# EAGLE board v6 (EAGLE 9.6.2)
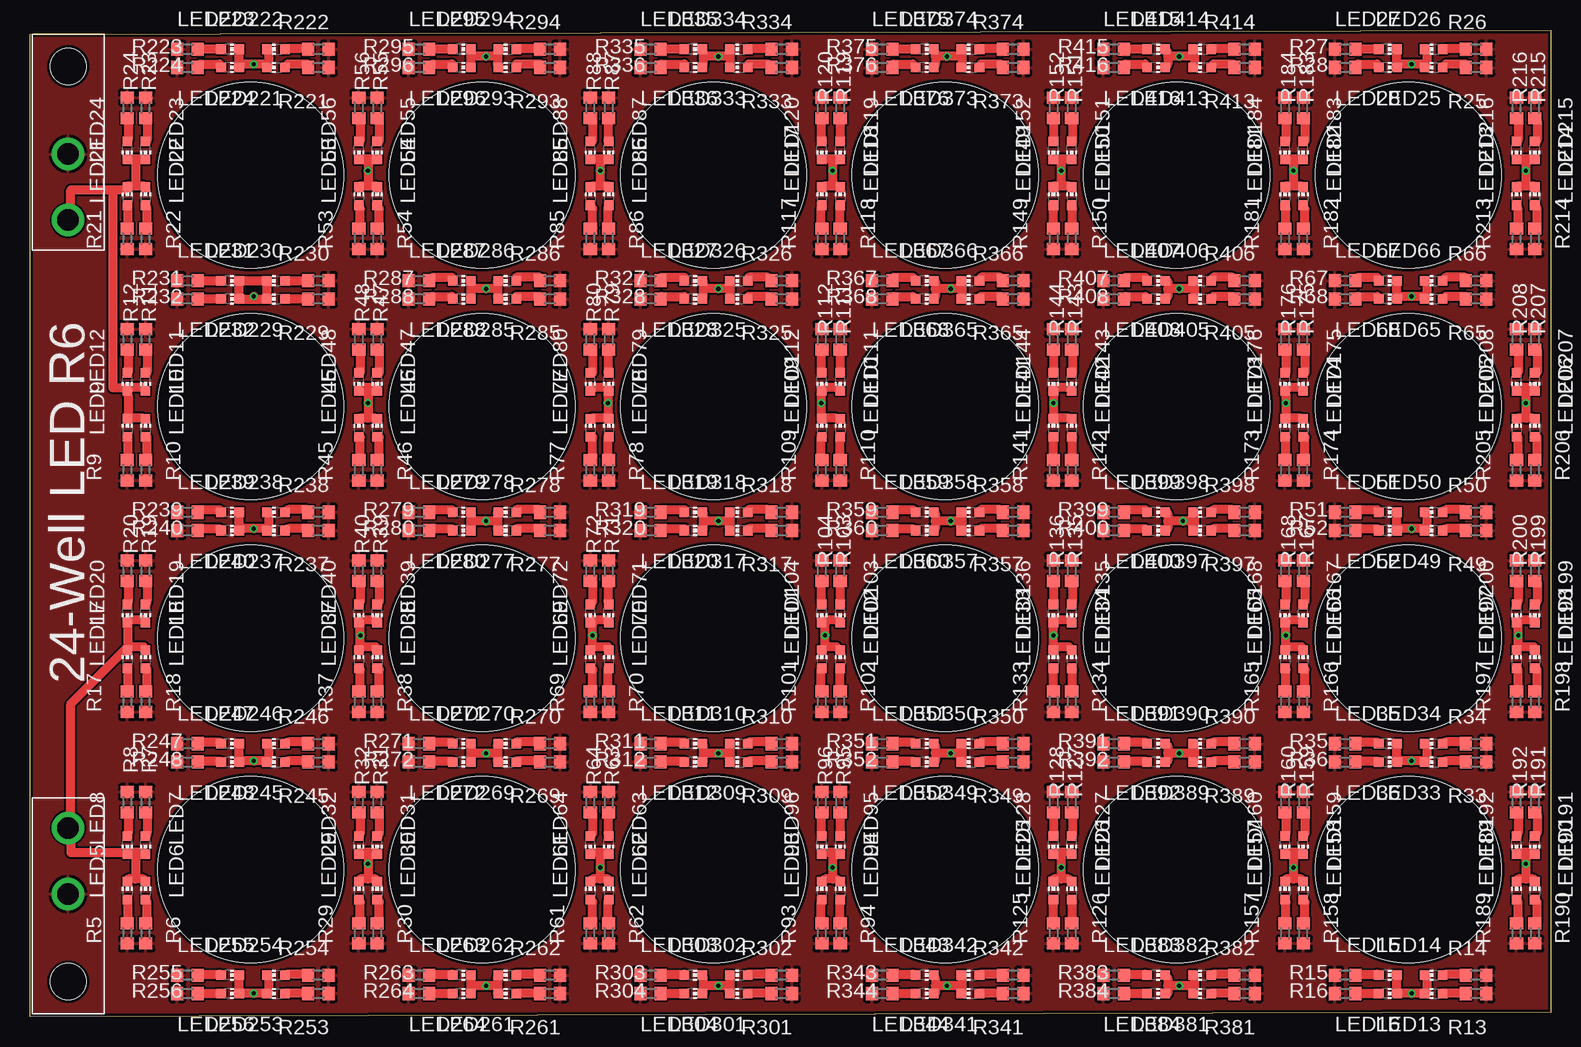
[diagram p1: board, top side]
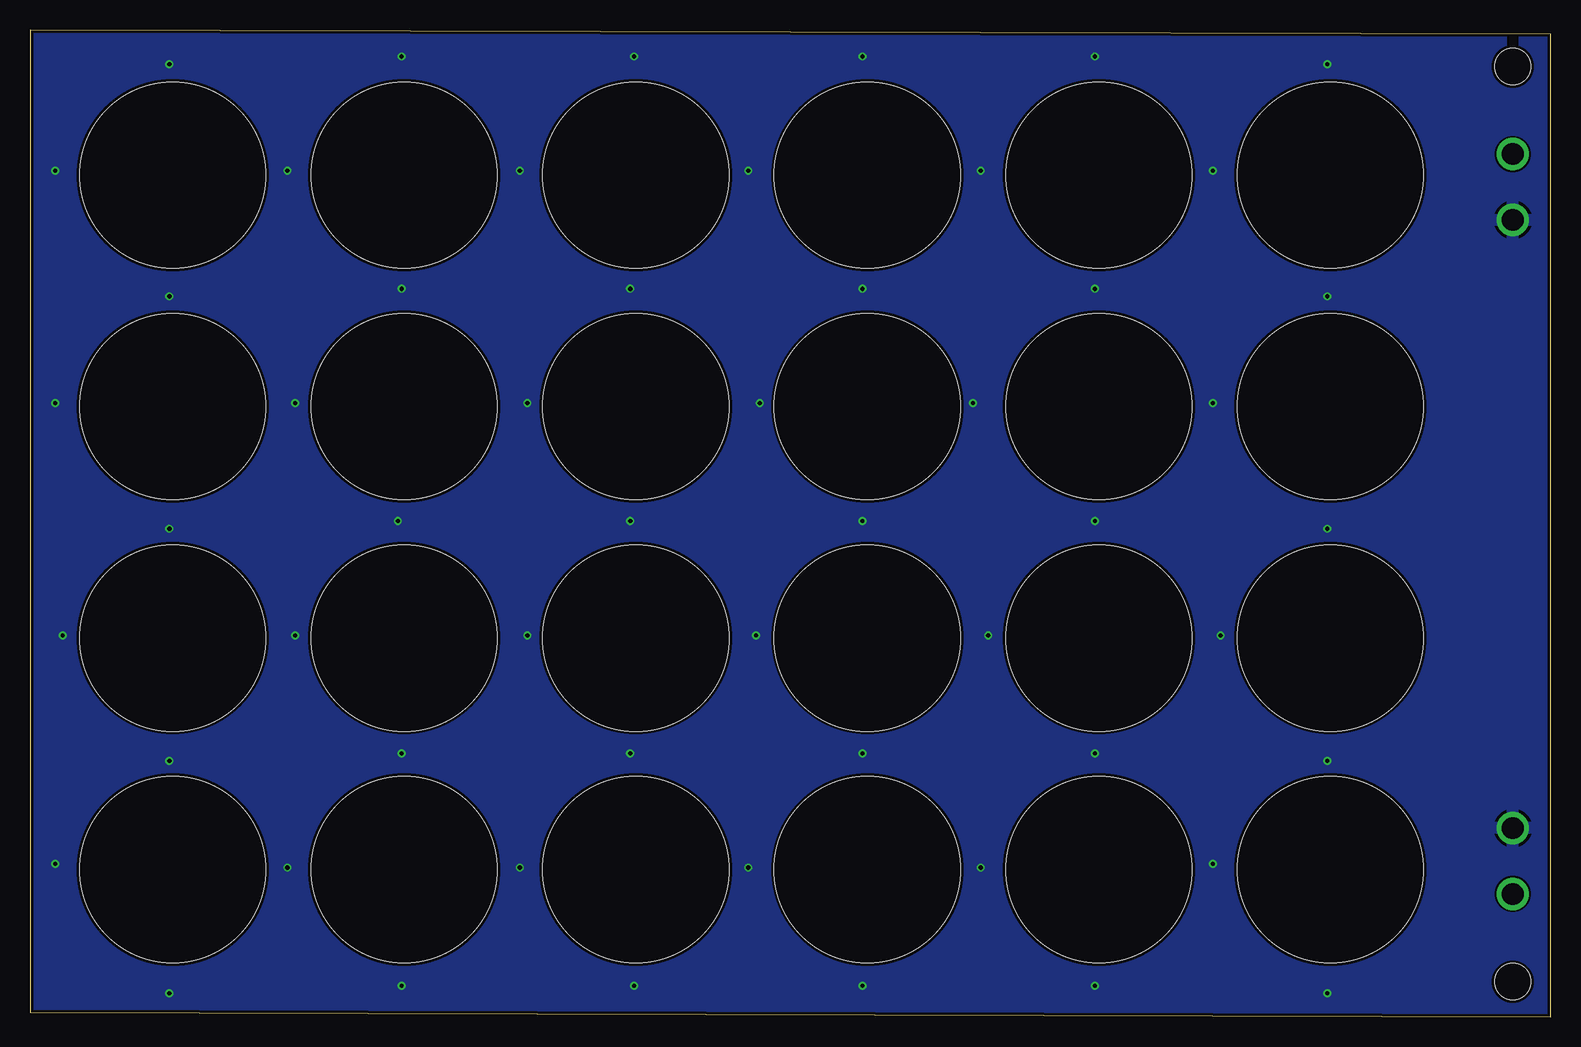
[diagram p2: board, bottom side, seen from below]

Size 126.78 x 82.25 mm. Coordinates in mm from the lower left corner, seen from the top.
Outline: 0,0 0,81.9 126.78,82.25 126.78,0.35 0,0
Copper layers (1*16): Top 0.035mm / dielectric 1.5mm / Bottom 0.035mm
Design rules "default *": minimum track width 30mil, minimum drill 0.35mm, track to track 6mil, track to pad 6mil, pad to pad 6mil, via to via 6mil, smd to smd 6mil, copper to edge 10mil, drill to drill 6mil, minimum pad ring 10mil, minimum via ring 6mil, stop-mask expansion 4mil, vias tented up to drill 0mil, thermal gap 10mil
Holes 15.5 mm at 18.38,31.55 18.38,50.85 18.38,70.15 37.68,31.55 37.68,50.85 37.68,70.15 56.98,31.55 56.98,50.85 56.98,70.15 76.28,31.55 76.28,50.85 76.28,70.15 95.58,31.55 95.58,50.85 95.58,70.15 114.88,70.15 114.88,50.85 114.88,31.55 18.38,12.25 37.68,12.25 56.98,12.25 76.28,12.25 95.58,12.25 114.88,12.25

## Footprints (pad centres in the part's own frame; a part is rotated, then mirrored left to right if it is on the bottom)
CHIP-LED0603 = smd 0.8 x 0.8: A 0,-0.75; C 0,0.75
R0603 = smd 1 x 1.1: 1 -0.85,0; 2 0.85,0
MINI-FIT_JR_CONN = drill 1.8: P$1 0,0; P$2 0,5.5 | hole 3: 0,-7.3

## Placement (x,y rotation side)
LED5  [CHIP-LED0603]  8.12,10.5 0 top
LED6  [CHIP-LED0603]  9.64,10.5 0 top
LED7  [CHIP-LED0603]  9.64,14.31 180 top
LED8  [CHIP-LED0603]  8.12,14.31 180 top
LED9  [CHIP-LED0603]  8.12,49.1 0 top
LED10  [CHIP-LED0603]  9.64,49.1 0 top
LED11  [CHIP-LED0603]  9.64,52.91 180 top
LED12  [CHIP-LED0603]  8.12,52.91 180 top
LED13  [CHIP-LED0603]  117,1.92 90 top
LED14  [CHIP-LED0603]  117,3.45 90 top
LED15  [CHIP-LED0603]  113.19,3.45 270 top
LED16  [CHIP-LED0603]  113.19,1.92 270 top
LED17  [CHIP-LED0603]  8.12,29.8 0 top
LED18  [CHIP-LED0603]  9.64,29.8 0 top
LED19  [CHIP-LED0603]  9.64,33.61 180 top
LED20  [CHIP-LED0603]  8.12,33.61 180 top
LED21  [CHIP-LED0603]  8.12,68.4 0 top
LED22  [CHIP-LED0603]  9.64,68.4 0 top
LED23  [CHIP-LED0603]  9.64,72.21 180 top
LED24  [CHIP-LED0603]  8.12,72.21 180 top
LED25  [CHIP-LED0603]  117,79.12 90 top
LED26  [CHIP-LED0603]  117,80.65 90 top
LED27  [CHIP-LED0603]  113.19,80.65 270 top
LED28  [CHIP-LED0603]  113.19,79.12 270 top
LED29  [CHIP-LED0603]  27.42,10.5 0 top
LED30  [CHIP-LED0603]  28.94,10.5 0 top
LED31  [CHIP-LED0603]  28.94,14.31 180 top
LED32  [CHIP-LED0603]  27.42,14.31 180 top
LED33  [CHIP-LED0603]  117,21.22 90 top
LED34  [CHIP-LED0603]  117,22.75 90 top
LED35  [CHIP-LED0603]  113.19,22.75 270 top
LED36  [CHIP-LED0603]  113.19,21.22 270 top
LED37  [CHIP-LED0603]  27.42,29.8 0 top
LED38  [CHIP-LED0603]  28.94,29.8 0 top
LED39  [CHIP-LED0603]  28.94,33.61 180 top
LED40  [CHIP-LED0603]  27.42,33.61 180 top
LED45  [CHIP-LED0603]  27.42,49.1 0 top
LED46  [CHIP-LED0603]  28.94,49.1 0 top
LED47  [CHIP-LED0603]  28.94,52.91 180 top
LED48  [CHIP-LED0603]  27.42,52.91 180 top
LED49  [CHIP-LED0603]  117,40.52 90 top
LED50  [CHIP-LED0603]  117,42.05 90 top
LED51  [CHIP-LED0603]  113.19,42.05 270 top
LED52  [CHIP-LED0603]  113.19,40.52 270 top
LED53  [CHIP-LED0603]  27.42,68.4 0 top
LED54  [CHIP-LED0603]  28.94,68.4 0 top
LED55  [CHIP-LED0603]  28.94,72.21 180 top
LED56  [CHIP-LED0603]  27.42,72.21 180 top
LED61  [CHIP-LED0603]  46.72,10.5 0 top
LED62  [CHIP-LED0603]  48.24,10.5 0 top
LED63  [CHIP-LED0603]  48.24,14.31 180 top
LED64  [CHIP-LED0603]  46.72,14.31 180 top
LED65  [CHIP-LED0603]  117,59.82 90 top
LED66  [CHIP-LED0603]  117,61.35 90 top
LED67  [CHIP-LED0603]  113.19,61.35 270 top
LED68  [CHIP-LED0603]  113.19,59.82 270 top
LED69  [CHIP-LED0603]  46.72,29.8 0 top
LED70  [CHIP-LED0603]  48.24,29.8 0 top
LED71  [CHIP-LED0603]  48.24,33.61 180 top
LED72  [CHIP-LED0603]  46.72,33.61 180 top
LED77  [CHIP-LED0603]  46.72,49.1 0 top
LED78  [CHIP-LED0603]  48.24,49.1 0 top
LED79  [CHIP-LED0603]  48.24,52.91 180 top
LED80  [CHIP-LED0603]  46.72,52.91 180 top
LED85  [CHIP-LED0603]  46.72,68.4 0 top
LED86  [CHIP-LED0603]  48.24,68.4 0 top
LED87  [CHIP-LED0603]  48.24,72.21 180 top
LED88  [CHIP-LED0603]  46.72,72.21 180 top
LED93  [CHIP-LED0603]  66.02,10.5 0 top
LED94  [CHIP-LED0603]  67.54,10.5 0 top
LED95  [CHIP-LED0603]  67.54,14.31 180 top
LED96  [CHIP-LED0603]  66.02,14.31 180 top
LED101  [CHIP-LED0603]  66.02,29.8 0 top
LED102  [CHIP-LED0603]  67.54,29.8 0 top
LED103  [CHIP-LED0603]  67.54,33.61 180 top
LED104  [CHIP-LED0603]  66.02,33.61 180 top
LED109  [CHIP-LED0603]  66.02,49.1 0 top
LED110  [CHIP-LED0603]  67.54,49.1 0 top
LED111  [CHIP-LED0603]  67.54,52.91 180 top
LED112  [CHIP-LED0603]  66.02,52.91 180 top
LED117  [CHIP-LED0603]  66.02,68.4 0 top
LED118  [CHIP-LED0603]  67.54,68.4 0 top
LED119  [CHIP-LED0603]  67.54,72.21 180 top
LED120  [CHIP-LED0603]  66.02,72.21 180 top
LED125  [CHIP-LED0603]  85.32,10.5 0 top
LED126  [CHIP-LED0603]  86.84,10.5 0 top
LED127  [CHIP-LED0603]  86.84,14.31 180 top
LED128  [CHIP-LED0603]  85.32,14.31 180 top
LED133  [CHIP-LED0603]  85.32,29.8 0 top
LED134  [CHIP-LED0603]  86.84,29.8 0 top
LED135  [CHIP-LED0603]  86.84,33.61 180 top
LED136  [CHIP-LED0603]  85.32,33.61 180 top
LED141  [CHIP-LED0603]  85.32,49.1 0 top
LED142  [CHIP-LED0603]  86.84,49.1 0 top
LED143  [CHIP-LED0603]  86.84,52.91 180 top
LED144  [CHIP-LED0603]  85.32,52.91 180 top
LED149  [CHIP-LED0603]  85.32,68.4 0 top
LED150  [CHIP-LED0603]  86.84,68.4 0 top
LED151  [CHIP-LED0603]  86.84,72.21 180 top
LED152  [CHIP-LED0603]  85.32,72.21 180 top
LED157  [CHIP-LED0603]  104.62,10.5 0 top
LED158  [CHIP-LED0603]  106.14,10.5 0 top
LED159  [CHIP-LED0603]  106.14,14.31 180 top
LED160  [CHIP-LED0603]  104.62,14.31 180 top
LED165  [CHIP-LED0603]  104.62,29.8 0 top
LED166  [CHIP-LED0603]  106.14,29.8 0 top
LED167  [CHIP-LED0603]  106.14,33.61 180 top
LED168  [CHIP-LED0603]  104.62,33.61 180 top
LED173  [CHIP-LED0603]  104.62,49.1 0 top
LED174  [CHIP-LED0603]  106.14,49.1 0 top
LED175  [CHIP-LED0603]  106.14,52.91 180 top
LED176  [CHIP-LED0603]  104.62,52.91 180 top
LED181  [CHIP-LED0603]  104.62,68.4 0 top
LED182  [CHIP-LED0603]  106.14,68.4 0 top
LED183  [CHIP-LED0603]  106.14,72.21 180 top
LED184  [CHIP-LED0603]  104.62,72.21 180 top
LED189  [CHIP-LED0603]  123.92,10.5 0 top
LED190  [CHIP-LED0603]  125.44,10.5 0 top
LED191  [CHIP-LED0603]  125.44,14.31 180 top
LED192  [CHIP-LED0603]  123.92,14.31 180 top
LED197  [CHIP-LED0603]  123.92,29.8 0 top
LED198  [CHIP-LED0603]  125.44,29.8 0 top
LED199  [CHIP-LED0603]  125.44,33.61 180 top
LED200  [CHIP-LED0603]  123.92,33.61 180 top
LED205  [CHIP-LED0603]  123.92,49.1 0 top
LED206  [CHIP-LED0603]  125.44,49.1 0 top
LED207  [CHIP-LED0603]  125.44,52.91 180 top
LED208  [CHIP-LED0603]  123.92,52.91 180 top
LED213  [CHIP-LED0603]  123.92,68.4 0 top
LED214  [CHIP-LED0603]  125.44,68.4 0 top
LED215  [CHIP-LED0603]  125.44,72.21 180 top
LED216  [CHIP-LED0603]  123.92,72.21 180 top
LED221  [CHIP-LED0603]  20.5,79.12 90 top
LED222  [CHIP-LED0603]  20.5,80.65 90 top
LED223  [CHIP-LED0603]  16.69,80.65 270 top
LED224  [CHIP-LED0603]  16.69,79.12 270 top
LED229  [CHIP-LED0603]  20.5,59.82 90 top
LED230  [CHIP-LED0603]  20.5,61.35 90 top
LED231  [CHIP-LED0603]  16.69,61.35 270 top
LED232  [CHIP-LED0603]  16.69,59.82 270 top
LED237  [CHIP-LED0603]  20.5,40.52 90 top
LED238  [CHIP-LED0603]  20.5,42.05 90 top
LED239  [CHIP-LED0603]  16.69,42.05 270 top
LED240  [CHIP-LED0603]  16.69,40.52 270 top
LED245  [CHIP-LED0603]  20.5,21.22 90 top
LED246  [CHIP-LED0603]  20.5,22.75 90 top
LED247  [CHIP-LED0603]  16.69,22.75 270 top
LED248  [CHIP-LED0603]  16.69,21.22 270 top
LED253  [CHIP-LED0603]  20.5,1.92 90 top
LED254  [CHIP-LED0603]  20.5,3.45 90 top
LED255  [CHIP-LED0603]  16.69,3.45 270 top
LED256  [CHIP-LED0603]  16.69,1.92 270 top
LED261  [CHIP-LED0603]  39.8,1.92 90 top
LED262  [CHIP-LED0603]  39.8,3.45 90 top
LED263  [CHIP-LED0603]  35.99,3.45 270 top
LED264  [CHIP-LED0603]  35.99,1.92 270 top
LED269  [CHIP-LED0603]  39.8,21.22 90 top
LED270  [CHIP-LED0603]  39.8,22.75 90 top
LED271  [CHIP-LED0603]  35.99,22.75 270 top
LED272  [CHIP-LED0603]  35.99,21.22 270 top
LED277  [CHIP-LED0603]  39.8,40.52 90 top
LED278  [CHIP-LED0603]  39.8,42.05 90 top
LED279  [CHIP-LED0603]  35.99,42.05 270 top
LED280  [CHIP-LED0603]  35.99,40.52 270 top
LED285  [CHIP-LED0603]  39.8,59.82 90 top
LED286  [CHIP-LED0603]  39.8,61.35 90 top
LED287  [CHIP-LED0603]  35.99,61.35 270 top
LED288  [CHIP-LED0603]  35.99,59.82 270 top
LED293  [CHIP-LED0603]  39.8,79.12 90 top
LED294  [CHIP-LED0603]  39.8,80.65 90 top
LED295  [CHIP-LED0603]  35.99,80.65 270 top
LED296  [CHIP-LED0603]  35.99,79.12 270 top
LED301  [CHIP-LED0603]  59.1,1.92 90 top
LED302  [CHIP-LED0603]  59.1,3.45 90 top
LED303  [CHIP-LED0603]  55.29,3.45 270 top
LED304  [CHIP-LED0603]  55.29,1.92 270 top
LED309  [CHIP-LED0603]  59.1,21.22 90 top
LED310  [CHIP-LED0603]  59.1,22.75 90 top
LED311  [CHIP-LED0603]  55.29,22.75 270 top
LED312  [CHIP-LED0603]  55.29,21.22 270 top
LED317  [CHIP-LED0603]  59.1,40.52 90 top
LED318  [CHIP-LED0603]  59.1,42.05 90 top
LED319  [CHIP-LED0603]  55.29,42.05 270 top
LED320  [CHIP-LED0603]  55.29,40.52 270 top
LED325  [CHIP-LED0603]  59.1,59.82 90 top
LED326  [CHIP-LED0603]  59.1,61.35 90 top
LED327  [CHIP-LED0603]  55.29,61.35 270 top
LED328  [CHIP-LED0603]  55.29,59.82 270 top
LED333  [CHIP-LED0603]  59.1,79.12 90 top
LED334  [CHIP-LED0603]  59.1,80.65 90 top
LED335  [CHIP-LED0603]  55.29,80.65 270 top
LED336  [CHIP-LED0603]  55.29,79.12 270 top
LED341  [CHIP-LED0603]  78.4,1.92 90 top
LED342  [CHIP-LED0603]  78.4,3.45 90 top
LED343  [CHIP-LED0603]  74.59,3.45 270 top
LED344  [CHIP-LED0603]  74.59,1.92 270 top
LED349  [CHIP-LED0603]  78.4,21.22 90 top
LED350  [CHIP-LED0603]  78.4,22.75 90 top
LED351  [CHIP-LED0603]  74.59,22.75 270 top
LED352  [CHIP-LED0603]  74.59,21.22 270 top
LED357  [CHIP-LED0603]  78.4,40.52 90 top
LED358  [CHIP-LED0603]  78.4,42.05 90 top
LED359  [CHIP-LED0603]  74.59,42.05 270 top
LED360  [CHIP-LED0603]  74.59,40.52 270 top
LED365  [CHIP-LED0603]  78.4,59.82 90 top
LED366  [CHIP-LED0603]  78.4,61.35 90 top
LED367  [CHIP-LED0603]  74.59,61.35 270 top
LED368  [CHIP-LED0603]  74.59,59.82 270 top
LED373  [CHIP-LED0603]  78.4,79.12 90 top
LED374  [CHIP-LED0603]  78.4,80.65 90 top
LED375  [CHIP-LED0603]  74.59,80.65 270 top
LED376  [CHIP-LED0603]  74.59,79.12 270 top
LED381  [CHIP-LED0603]  97.7,1.92 90 top
LED382  [CHIP-LED0603]  97.7,3.45 90 top
LED383  [CHIP-LED0603]  93.89,3.45 270 top
LED384  [CHIP-LED0603]  93.89,1.92 270 top
LED389  [CHIP-LED0603]  97.7,21.22 90 top
LED390  [CHIP-LED0603]  97.7,22.75 90 top
LED391  [CHIP-LED0603]  93.89,22.75 270 top
LED392  [CHIP-LED0603]  93.89,21.22 270 top
LED397  [CHIP-LED0603]  97.7,40.52 90 top
LED398  [CHIP-LED0603]  97.7,42.05 90 top
LED399  [CHIP-LED0603]  93.89,42.05 270 top
LED400  [CHIP-LED0603]  93.89,40.52 270 top
LED405  [CHIP-LED0603]  97.7,59.82 90 top
LED406  [CHIP-LED0603]  97.7,61.35 90 top
LED407  [CHIP-LED0603]  93.89,61.35 270 top
LED408  [CHIP-LED0603]  93.89,59.82 270 top
LED413  [CHIP-LED0603]  97.7,79.12 90 top
LED414  [CHIP-LED0603]  97.7,80.65 90 top
LED415  [CHIP-LED0603]  93.89,80.65 270 top
LED416  [CHIP-LED0603]  93.89,79.12 270 top
R5  [R0603]  8.12,6.94 90 top
R6  [R0603]  9.64,6.94 90 top
R7  [R0603]  9.64,17.86 270 top
R8  [R0603]  8.12,17.86 270 top
R9  [R0603]  8.12,45.54 90 top
R10  [R0603]  9.64,45.54 90 top
R11  [R0603]  9.64,56.46 270 top
R12  [R0603]  8.12,56.46 270 top
R13  [R0603]  120.55,1.92 180 top
R14  [R0603]  120.55,3.45 180 top
R15  [R0603]  109.63,3.45 0 top
R16  [R0603]  109.63,1.92 0 top
R17  [R0603]  8.12,26.24 90 top
R18  [R0603]  9.64,26.24 90 top
R19  [R0603]  9.64,37.16 270 top
R20  [R0603]  8.12,37.16 270 top
R21  [R0603]  8.12,64.84 90 top
R22  [R0603]  9.64,64.84 90 top
R23  [R0603]  9.64,75.76 270 top
R24  [R0603]  8.12,75.76 270 top
R25  [R0603]  120.55,79.12 180 top
R26  [R0603]  120.55,80.65 180 top
R27  [R0603]  109.63,80.65 0 top
R28  [R0603]  109.63,79.12 0 top
R29  [R0603]  27.42,6.94 90 top
R30  [R0603]  28.94,6.94 90 top
R31  [R0603]  28.94,17.86 270 top
R32  [R0603]  27.42,17.86 270 top
R33  [R0603]  120.55,21.22 180 top
R34  [R0603]  120.55,22.75 180 top
R35  [R0603]  109.63,22.75 0 top
R36  [R0603]  109.63,21.22 0 top
R37  [R0603]  27.42,26.24 90 top
R38  [R0603]  28.94,26.24 90 top
R39  [R0603]  28.94,37.16 270 top
R40  [R0603]  27.42,37.16 270 top
R45  [R0603]  27.42,45.54 90 top
R46  [R0603]  28.94,45.54 90 top
R47  [R0603]  28.94,56.46 270 top
R48  [R0603]  27.42,56.46 270 top
R49  [R0603]  120.55,40.52 180 top
R50  [R0603]  120.55,42.05 180 top
R51  [R0603]  109.63,42.05 0 top
R52  [R0603]  109.63,40.52 0 top
R53  [R0603]  27.42,64.84 90 top
R54  [R0603]  28.94,64.84 90 top
R55  [R0603]  28.94,75.76 270 top
R56  [R0603]  27.42,75.76 270 top
R61  [R0603]  46.72,6.94 90 top
R62  [R0603]  48.24,6.94 90 top
R63  [R0603]  48.24,17.86 270 top
R64  [R0603]  46.72,17.86 270 top
R65  [R0603]  120.55,59.82 180 top
R66  [R0603]  120.55,61.35 180 top
R67  [R0603]  109.63,61.35 0 top
R68  [R0603]  109.63,59.82 0 top
R69  [R0603]  46.72,26.24 90 top
R70  [R0603]  48.24,26.24 90 top
R71  [R0603]  48.24,37.16 270 top
R72  [R0603]  46.72,37.16 270 top
R77  [R0603]  46.72,45.54 90 top
R78  [R0603]  48.24,45.54 90 top
R79  [R0603]  48.24,56.46 270 top
R80  [R0603]  46.72,56.46 270 top
R85  [R0603]  46.72,64.84 90 top
R86  [R0603]  48.24,64.84 90 top
R87  [R0603]  48.24,75.76 270 top
R88  [R0603]  46.72,75.76 270 top
R93  [R0603]  66.02,6.94 90 top
R94  [R0603]  67.54,6.94 90 top
R95  [R0603]  67.54,17.86 270 top
R96  [R0603]  66.02,17.86 270 top
R101  [R0603]  66.02,26.24 90 top
R102  [R0603]  67.54,26.24 90 top
R103  [R0603]  67.54,37.16 270 top
R104  [R0603]  66.02,37.16 270 top
R109  [R0603]  66.02,45.54 90 top
R110  [R0603]  67.54,45.54 90 top
R111  [R0603]  67.54,56.46 270 top
R112  [R0603]  66.02,56.46 270 top
R117  [R0603]  66.02,64.84 90 top
R118  [R0603]  67.54,64.84 90 top
R119  [R0603]  67.54,75.76 270 top
R120  [R0603]  66.02,75.76 270 top
R125  [R0603]  85.32,6.94 90 top
R126  [R0603]  86.84,6.94 90 top
R127  [R0603]  86.84,17.86 270 top
R128  [R0603]  85.32,17.86 270 top
R133  [R0603]  85.32,26.24 90 top
R134  [R0603]  86.84,26.24 90 top
R135  [R0603]  86.84,37.16 270 top
R136  [R0603]  85.32,37.16 270 top
R141  [R0603]  85.32,45.54 90 top
R142  [R0603]  86.84,45.54 90 top
R143  [R0603]  86.84,56.46 270 top
R144  [R0603]  85.32,56.46 270 top
R149  [R0603]  85.32,64.84 90 top
R150  [R0603]  86.84,64.84 90 top
R151  [R0603]  86.84,75.76 270 top
R152  [R0603]  85.32,75.76 270 top
R157  [R0603]  104.62,6.94 90 top
R158  [R0603]  106.14,6.94 90 top
R159  [R0603]  106.14,17.86 270 top
R160  [R0603]  104.62,17.86 270 top
R165  [R0603]  104.62,26.24 90 top
R166  [R0603]  106.14,26.24 90 top
R167  [R0603]  106.14,37.16 270 top
R168  [R0603]  104.62,37.16 270 top
R173  [R0603]  104.62,45.54 90 top
R174  [R0603]  106.14,45.54 90 top
R175  [R0603]  106.14,56.46 270 top
R176  [R0603]  104.62,56.46 270 top
R181  [R0603]  104.62,64.84 90 top
R182  [R0603]  106.14,64.84 90 top
R183  [R0603]  106.14,75.76 270 top
R184  [R0603]  104.62,75.76 270 top
R189  [R0603]  123.92,6.94 90 top
R190  [R0603]  125.44,6.94 90 top
R191  [R0603]  125.44,17.86 270 top
R192  [R0603]  123.92,17.86 270 top
R197  [R0603]  123.92,26.24 90 top
R198  [R0603]  125.44,26.24 90 top
R199  [R0603]  125.44,37.16 270 top
R200  [R0603]  123.92,37.16 270 top
R205  [R0603]  123.92,45.54 90 top
R206  [R0603]  125.44,45.54 90 top
R207  [R0603]  125.44,56.46 270 top
R208  [R0603]  123.92,56.46 270 top
R213  [R0603]  123.92,64.84 90 top
R214  [R0603]  125.44,64.84 90 top
R215  [R0603]  125.44,75.76 270 top
R216  [R0603]  123.92,75.76 270 top
R221  [R0603]  24.05,79.12 180 top
R222  [R0603]  24.05,80.65 180 top
R223  [R0603]  13.13,80.65 0 top
R224  [R0603]  13.13,79.12 0 top
R229  [R0603]  24.05,59.82 180 top
R230  [R0603]  24.05,61.35 180 top
R231  [R0603]  13.13,61.35 0 top
R232  [R0603]  13.13,59.82 0 top
R237  [R0603]  24.05,40.52 180 top
R238  [R0603]  24.05,42.05 180 top
R239  [R0603]  13.13,42.05 0 top
R240  [R0603]  13.13,40.52 0 top
R245  [R0603]  24.05,21.22 180 top
R246  [R0603]  24.05,22.75 180 top
R247  [R0603]  13.13,22.75 0 top
R248  [R0603]  13.13,21.22 0 top
R253  [R0603]  24.05,1.92 180 top
R254  [R0603]  24.05,3.45 180 top
R255  [R0603]  13.13,3.45 0 top
R256  [R0603]  13.13,1.92 0 top
R261  [R0603]  43.35,1.92 180 top
R262  [R0603]  43.35,3.45 180 top
R263  [R0603]  32.43,3.45 0 top
R264  [R0603]  32.43,1.92 0 top
R269  [R0603]  43.35,21.22 180 top
R270  [R0603]  43.35,22.75 180 top
R271  [R0603]  32.43,22.75 0 top
R272  [R0603]  32.43,21.22 0 top
R277  [R0603]  43.35,40.52 180 top
R278  [R0603]  43.35,42.05 180 top
R279  [R0603]  32.43,42.05 0 top
R280  [R0603]  32.43,40.52 0 top
R285  [R0603]  43.35,59.82 180 top
R286  [R0603]  43.35,61.35 180 top
R287  [R0603]  32.43,61.35 0 top
R288  [R0603]  32.43,59.82 0 top
R293  [R0603]  43.35,79.12 180 top
R294  [R0603]  43.35,80.65 180 top
R295  [R0603]  32.43,80.65 0 top
R296  [R0603]  32.43,79.12 0 top
R301  [R0603]  62.65,1.92 180 top
R302  [R0603]  62.65,3.45 180 top
R303  [R0603]  51.73,3.45 0 top
R304  [R0603]  51.73,1.92 0 top
R309  [R0603]  62.65,21.22 180 top
R310  [R0603]  62.65,22.75 180 top
R311  [R0603]  51.73,22.75 0 top
R312  [R0603]  51.73,21.22 0 top
R317  [R0603]  62.65,40.52 180 top
R318  [R0603]  62.65,42.05 180 top
R319  [R0603]  51.73,42.05 0 top
R320  [R0603]  51.73,40.52 0 top
R325  [R0603]  62.65,59.82 180 top
R326  [R0603]  62.65,61.35 180 top
R327  [R0603]  51.73,61.35 0 top
R328  [R0603]  51.73,59.82 0 top
R333  [R0603]  62.65,79.12 180 top
R334  [R0603]  62.65,80.65 180 top
R335  [R0603]  51.73,80.65 0 top
R336  [R0603]  51.73,79.12 0 top
R341  [R0603]  81.95,1.92 180 top
R342  [R0603]  81.95,3.45 180 top
R343  [R0603]  71.03,3.45 0 top
R344  [R0603]  71.03,1.92 0 top
R349  [R0603]  81.95,21.22 180 top
R350  [R0603]  81.95,22.75 180 top
R351  [R0603]  71.03,22.75 0 top
R352  [R0603]  71.03,21.22 0 top
R357  [R0603]  81.95,40.52 180 top
R358  [R0603]  81.95,42.05 180 top
R359  [R0603]  71.03,42.05 0 top
R360  [R0603]  71.03,40.52 0 top
R365  [R0603]  81.95,59.82 180 top
R366  [R0603]  81.95,61.35 180 top
R367  [R0603]  71.03,61.35 0 top
R368  [R0603]  71.03,59.82 0 top
R373  [R0603]  81.95,79.12 180 top
R374  [R0603]  81.95,80.65 180 top
R375  [R0603]  71.03,80.65 0 top
R376  [R0603]  71.03,79.12 0 top
R381  [R0603]  101.25,1.92 180 top
R382  [R0603]  101.25,3.45 180 top
R383  [R0603]  90.33,3.45 0 top
R384  [R0603]  90.33,1.92 0 top
R389  [R0603]  101.25,21.22 180 top
R390  [R0603]  101.25,22.75 180 top
R391  [R0603]  90.33,22.75 0 top
R392  [R0603]  90.33,21.22 0 top
R397  [R0603]  101.25,40.52 180 top
R398  [R0603]  101.25,42.05 180 top
R399  [R0603]  90.33,42.05 0 top
R400  [R0603]  90.33,40.52 0 top
R405  [R0603]  101.25,59.82 180 top
R406  [R0603]  101.25,61.35 180 top
R407  [R0603]  90.33,61.35 0 top
R408  [R0603]  90.33,59.82 0 top
R413  [R0603]  101.25,79.12 180 top
R414  [R0603]  101.25,80.65 180 top
R415  [R0603]  90.33,80.65 0 top
R416  [R0603]  90.33,79.12 0 top
U$1  MOLEX_0039301022  [MINI-FIT_JR_CONN]  3.18,10.21 0 top
U$2  MOLEX_0039301022  [MINI-FIT_JR_CONN]  3.18,71.91 180 top

## Tracks (layer width: path | path; a pad name or v marks a point on that pad's centre or on a via)
GNDSSS  (via drill 0.35)
  Top 0.762: 18.65,59.82 LED232.C LED231.C LED230.C LED229.C 18.65,59.82 | 124.69,49.88 125.33,49.88 LED206.C | 124.69,49.88 124.06,49.88 LED205.C | 124.69,52.42 125.33,52.42 LED207.C | 124.69,52.42 124.06,52.42 LED208.C | 124.69,52.42 v124.69,51.15 124.69,49.88 | LED174.C 105.96,49.88 104.69,49.88 LED173.C 104.69,50.2 v104.69,51.15 104.69,51.79 LED176.C 104.69,52.42 105.96,52.42 LED175.C | LED142.C 86.59,49.88 85.32,49.88 LED141.C 85.32,50.2 v85.32,51.15 85.32,51.79 LED144.C 85.32,52.42 86.59,52.42 LED143.C | LED110.C 67.22,49.88 66.27,49.88 LED109.C 65.95,50.2 v65.95,51.15 65.95,51.79 LED112.C 66.27,52.42 67.22,52.42 LED111.C | LED77.C 46.9,49.88 48.17,49.88 LED78.C 48.17,50.2 v48.17,51.15 48.17,51.79 LED79.C 48.17,52.42 46.9,52.42 LED80.C | 28.17,49.88 28.81,49.88 LED46.C | 28.17,49.88 27.54,49.88 LED45.C | 28.17,52.42 28.81,52.42 LED47.C | 28.17,52.42 27.54,52.42 LED48.C | 28.17,52.42 v28.17,51.15 28.17,49.88 | LED10.C 9.44,49.88 8.17,49.88 LED9.C 8.17,50.2 8.17,51.79 LED12.C | LED12.C 8.17,52.42 9.44,52.42 LED11.C | 124.69,69.25 125.33,69.25 LED214.C | 124.69,69.25 124.06,69.25 LED213.C | 124.69,71.47 125.33,71.47 LED215.C | 124.69,71.47 124.06,71.47 LED216.C | 124.69,71.47 v124.69,70.52 124.69,69.25 | LED199.C 125.33,33.05 124.06,33.05 LED200.C 124.06,32.73 v124.06,31.78 124.06,30.83 | 124.06,30.83 125.33,30.83 LED198.C | 124.06,30.83 LED197.C | 124.69,11.46 125.33,11.46 LED190.C | 124.69,11.46 124.06,11.46 LED189.C | 124.69,13.69 125.33,13.69 LED191.C | 124.69,13.69 124.06,13.69 LED192.C | 124.69,13.69 v124.69,12.73 124.69,11.46 | LED27.C 113.9,80.36 113.9,79.41 LED28.C 114.21,79.41 v115.17,79.41 116.12,79.41 LED25.C 116.44,79.41 116.44,80.36 LED26.C
  Top 0.762: 105.32,69.25 105.96,69.25 LED182.C | 105.32,69.25 104.69,69.25 LED181.C | 105.32,71.47 105.96,71.47 LED183.C | 105.32,71.47 104.69,71.47 LED184.C | 105.32,71.47 v105.32,70.52 105.32,69.25 | 94.85,80.04 94.85,80.36 LED415.C | 94.85,80.04 94.85,79.41 LED416.C | 97.07,80.04 97.07,80.36 LED414.C | 97.07,80.04 97.07,79.41 LED413.C | 97.07,80.04 v95.8,80.04 94.85,80.04 | 85.96,69.25 86.59,69.25 LED150.C | 85.96,69.25 85.32,69.25 LED149.C | 85.96,71.47 86.59,71.47 LED151.C | 85.96,71.47 LED152.C | 85.96,71.47 v85.96,70.52 85.96,69.25 | LED67.C 113.9,61.31 113.9,60.04 LED68.C 114.21,60.04 v115.17,60.04 116.12,60.04 LED65.C 116.44,60.04 116.44,61.31 LED66.C | 75.48,80.04 75.48,80.36 LED375.C | 75.48,80.04 75.48,79.41 LED376.C | 77.7,80.04 77.7,80.36 LED374.C | 77.7,80.04 77.7,79.41 LED373.C | 77.7,80.04 v76.43,80.04 75.48,80.04 | 56.11,80.04 56.11,80.36 LED335.C | 56.11,80.04 56.11,79.41 LED336.C | 58.33,80.04 58.33,80.36 LED334.C | 58.33,80.04 58.33,79.41 LED333.C | 58.33,80.04 v57.38,80.04 56.11,80.04 | 66.91,69.25 67.22,69.25 LED118.C | 66.91,69.25 66.27,69.25 LED117.C | 66.91,71.47 67.22,71.47 LED119.C | 66.91,71.47 66.27,71.47 LED120.C | 66.91,71.47 v66.91,70.52 66.91,69.25 | 36.74,80.04 36.74,80.36 LED295.C | 36.74,80.04 36.74,79.41 LED296.C | 38.97,80.04 38.97,80.36 LED294.C | 38.97,80.04 38.97,79.41 LED293.C | 38.97,80.04 v38.01,80.04 36.74,80.04 | 47.54,69.25 48.17,69.25 LED86.C | 47.54,69.25 46.9,69.25 LED85.C | 47.54,71.47 48.17,71.47 LED87.C | 47.54,71.47 46.9,71.47 LED88.C | 47.54,71.47 v47.54,70.52 47.54,69.25 | 28.17,69.25 28.81,69.25 LED54.C | 28.17,69.25 27.54,69.25 LED53.C | 28.17,71.47 28.81,71.47 LED55.C
  Top 0.762: 28.17,71.47 27.54,71.47 LED56.C | 28.17,71.47 v28.17,70.52 28.17,69.25 | 94.85,60.68 94.85,61.31 LED407.C | 94.85,60.68 94.85,60.04 LED408.C | 97.07,60.68 97.07,61.31 LED406.C | 97.07,60.68 97.07,60.04 LED405.C | 97.07,60.68 v95.8,60.68 94.85,60.68 | LED51.C 113.9,41.94 113.9,40.67 LED52.C 114.21,40.67 v115.17,40.67 116.12,40.67 LED49.C 116.44,40.67 116.44,41.94 LED50.C | LED167.C 105.96,33.05 104.69,33.05 LED168.C 104.69,32.73 v104.69,31.78 104.69,30.83 | 104.69,30.83 105.96,30.83 LED166.C | 104.69,30.83 LED165.C | 75.48,60.68 75.48,61.31 LED367.C | 75.48,60.68 75.48,60.04 LED368.C | 77.7,60.68 77.7,61.31 LED366.C | 77.7,60.68 77.7,60.04 LED365.C | 77.7,60.68 v76.75,60.68 75.48,60.68 | 56.11,60.68 56.11,61.31 LED327.C | 56.11,60.68 56.11,60.04 LED328.C | 58.33,60.68 58.33,61.31 LED326.C | 58.33,60.68 58.33,60.04 LED325.C | 58.33,60.68 v57.38,60.68 56.11,60.68 | 36.74,60.68 36.74,61.31 LED287.C | 36.74,60.68 36.74,60.04 LED288.C | 38.97,60.68 38.97,61.31 LED286.C | 38.97,60.68 38.97,60.04 LED285.C | 38.97,60.68 v38.01,60.68 36.74,60.68 | LED35.C 113.9,22.58 113.9,21.3 LED36.C 114.21,21.3 v115.17,21.3 116.12,21.3 LED33.C 116.44,21.3 116.44,22.58 LED34.C | 105.32,11.46 105.96,11.46 LED158.C | 105.32,11.46 104.69,11.46 LED157.C | 105.32,13.69 105.96,13.69 LED159.C | 105.32,13.69 104.69,13.69 LED160.C | 105.32,13.69 v105.32,12.41 105.32,11.46 | 94.85,41.31 94.85,41.94 LED399.C | 94.85,41.31 94.85,40.67 LED400.C | 97.07,41.31 97.07,41.94 LED398.C | 97.07,41.31 97.07,40.67 LED397.C | 97.07,41.31 v96.12,41.31 94.85,41.31 | LED135.C 86.59,33.05 85.32,33.05 LED136.C 85.32,32.73 v85.32,31.78 85.32,30.83
  Top 0.762: 85.32,30.83 86.59,30.83 LED134.C | 85.32,30.83 LED133.C | 75.48,41.31 75.48,41.94 LED359.C | 75.48,41.31 75.48,40.67 LED360.C | 77.7,41.31 77.7,41.94 LED358.C | 77.7,41.31 77.7,40.67 LED357.C | 77.7,41.31 v76.75,41.31 75.48,41.31 | LED103.C 67.22,33.05 66.27,33.05 LED104.C 66.27,32.73 v66.27,31.78 66.27,30.83 | 66.27,30.83 67.22,30.83 LED102.C | 66.27,30.83 LED101.C | 56.11,41.31 56.11,41.94 LED319.C | 56.11,41.31 56.11,40.67 LED320.C | 58.33,41.31 58.33,41.94 LED318.C | 58.33,41.31 58.33,40.67 LED317.C | 58.33,41.31 v57.38,41.31 56.11,41.31 | 36.74,41.31 36.74,41.94 LED279.C | 36.74,41.31 36.74,40.67 LED280.C | 38.97,41.31 38.97,41.94 LED278.C | 38.97,41.31 38.97,40.67 LED277.C | 38.97,41.31 v38.01,41.31 36.74,41.31 | LED71.C 48.17,33.05 46.9,33.05 LED72.C 46.9,32.73 v46.9,31.78 46.9,30.83 | 46.9,30.83 48.17,30.83 LED70.C | 46.9,30.83 LED69.C | LED39.C 28.81,33.05 27.54,33.05 LED40.C 27.54,32.73 v27.54,31.78 27.54,30.83 | 27.54,30.83 28.81,30.83 LED38.C | 27.54,30.83 LED37.C | 94.85,21.94 94.85,22.58 LED391.C | 94.85,21.94 94.85,21.3 LED392.C | 97.07,21.94 97.07,22.58 LED390.C | 97.07,21.94 97.07,21.3 LED389.C | 97.07,21.94 v95.8,21.94 94.85,21.94 | 85.96,11.46 86.59,11.46 LED126.C | 85.96,11.46 85.32,11.46 LED125.C | 85.96,13.69 86.59,13.69 LED127.C | 85.96,13.69 85.32,13.69 LED128.C | 85.96,13.69 v85.96,12.41 85.96,11.46 | LED15.C 113.9,3.21 113.9,1.94 LED16.C 114.21,1.94 v115.17,1.94 116.12,1.94 LED13.C 116.44,1.94 116.44,3.21 LED14.C | LED223.C 17.38,80.36 17.38,79.41 LED224.C 17.69,79.41 v18.65,79.41 19.6,79.41 LED221.C 19.92,79.41 19.92,80.36 LED222.C | 8.8,69.25 9.44,69.25 LED22.C
  Top 0.762: 8.8,69.25 8.17,69.25 LED21.C 7.85,68.93 6.9,68.93 | 8.8,71.47 9.44,71.47 LED23.C | 8.8,71.47 8.17,71.47 LED24.C | 8.8,71.47 8.8,69.25 | 75.48,21.94 75.48,22.58 LED351.C | 75.48,21.94 75.48,21.3 LED352.C | 77.7,21.94 77.7,22.58 LED350.C | 77.7,21.94 77.7,21.3 LED349.C | 77.7,21.94 v76.75,21.94 75.48,21.94 | 56.11,21.94 56.11,22.58 LED311.C | 56.11,21.94 56.11,21.3 LED312.C | 58.33,21.94 58.33,22.58 LED310.C | 58.33,21.94 58.33,21.3 LED309.C | 58.33,21.94 v57.38,21.94 56.11,21.94 | 66.91,11.46 67.22,11.46 LED94.C | 66.91,11.46 66.27,11.46 LED93.C | 66.91,13.69 67.22,13.69 LED95.C | 66.91,13.69 66.27,13.69 LED96.C | 66.91,13.69 v66.91,12.41 66.91,11.46 | 36.74,21.94 36.74,22.58 LED271.C | 36.74,21.94 36.74,21.3 LED272.C | 38.97,21.94 38.97,22.58 LED270.C | 38.97,21.94 38.97,21.3 LED269.C | 38.97,21.94 v38.01,21.94 36.74,21.94 | 47.54,11.46 48.17,11.46 LED62.C | 47.54,11.46 46.9,11.46 LED61.C | 47.54,13.69 48.17,13.69 LED63.C | 47.54,13.69 46.9,13.69 LED64.C | 47.54,13.69 v47.54,12.41 47.54,11.46 | 28.17,11.46 28.81,11.46 LED30.C | 28.17,11.46 27.54,11.46 LED29.C | 28.17,13.69 28.81,13.69 LED31.C | 28.17,13.69 27.54,13.69 LED32.C | 28.17,13.69 v28.17,12.73 28.17,11.46 | 94.85,2.57 94.85,3.21 LED383.C | 94.85,2.57 94.85,1.94 LED384.C | 97.07,2.57 97.07,3.21 LED382.C | 97.07,2.57 97.07,1.94 LED381.C | 97.07,2.57 v95.8,2.57 94.85,2.57 | 75.48,2.57 75.48,3.21 LED343.C | 75.48,2.57 75.48,1.94 LED344.C | 77.7,2.57 77.7,3.21 LED342.C | 77.7,2.57 77.7,1.94 LED341.C | 77.7,2.57 v76.43,2.57 75.48,2.57 | 56.11,2.57 56.11,3.21 LED303.C | 56.11,2.57 56.11,1.94 LED304.C | 58.33,2.57 58.33,3.21 LED302.C | 58.33,2.57 58.33,1.94 LED301.C
  Top 0.762: 58.33,2.57 v57.38,2.57 56.11,2.57 | 36.74,2.57 36.74,3.21 LED263.C | 36.74,2.57 36.74,1.94 LED264.C | 38.97,2.57 38.97,3.21 LED262.C | 38.97,2.57 38.97,1.94 LED261.C | 38.97,2.57 v38.01,2.57 36.74,2.57 | LED239.C 17.38,41.94 17.38,40.67 LED240.C 17.69,40.67 v18.65,40.67 19.6,40.67 LED237.C 19.92,40.67 19.92,41.94 LED238.C | LED19.C 9.44,33.05 8.17,33.05 LED20.C 8.17,32.73 8.17,30.83 | 8.17,30.83 9.44,30.83 LED18.C | 8.17,30.83 LED17.C 7.85,30.51 3.41,26.07 3.41,15.91 U$1.P$2 3.41,15.59 3.41,13.69 7.85,13.69 LED8.C 8.17,13.69 8.8,13.69 | LED247.C 17.38,22.58 17.38,21.3 LED248.C 17.69,21.3 v18.65,21.3 19.6,21.3 LED245.C 19.92,21.3 19.92,22.58 LED246.C | LED255.C 17.38,3.21 17.38,1.94 LED256.C 17.69,1.94 v18.65,1.94 19.6,1.94 LED253.C 19.92,1.94 19.92,3.21 LED254.C | 8.8,11.46 9.44,11.46 LED6.C | 8.8,11.46 8.17,11.46 LED5.C | 8.8,13.69 9.44,13.69 LED7.C | 8.8,13.69 8.8,11.46 | 6.9,68.93 3.41,68.93 3.41,66.71 U$2.P$2 | v18.65,60.04 18.65,59.82 | 6.9,68.93 6.9,52.42 7.85,52.42 LED12.C
  pour Bottom: -17.36,82.25 126.91,82.25 126.91,0.35 -17.36,0.35
N$1
  Top 0.762: LED5.A 8.17,9.56 8.17,7.97 R5.2
N$2
  Top 0.762: LED6.A 9.76,9.56 9.76,7.97 R6.2
N$3
  Top 0.762: LED7.A 9.76,15.27 9.76,16.86 R7.2
N$4
  Top 0.762: LED8.A 8.17,15.27 8.17,16.86 R8.2
N$5
  Top 0.762: LED9.A 8.17,48.29 8.17,46.7 R9.2
N$6
  Top 0.762: LED10.A 9.76,48.29 9.76,46.7 R10.2
N$7
  Top 0.762: LED11.A 9.76,53.69 9.76,55.59 R11.2
N$8
  Top 0.762: LED12.A 8.17,53.69 8.17,55.59 R12.2
N$9
  Top 0.762: LED13.A 118.02,1.94 119.61,1.94 R13.2
N$10
  Top 0.762: LED14.A 118.02,3.52 119.61,3.52 R14.2
N$11
  Top 0.762: LED15.A 112.31,3.52 110.72,3.52 R15.2
N$12
  Top 0.762: LED16.A 112.31,1.94 110.72,1.94 R16.2
N$13
  Top 0.762: LED17.A 8.17,28.93 8.17,27.34 R17.2
N$14
  Top 0.762: LED18.A 9.76,28.93 9.76,27.34 R18.2
N$15
  Top 0.762: LED19.A 9.76,34.64 9.76,36.23 R19.2
N$16
  Top 0.762: LED20.A 8.17,34.64 8.17,36.23 R20.2
N$17
  Top 0.762: LED21.A 8.17,67.34 8.17,65.75 R21.2
N$18
  Top 0.762: LED22.A 9.76,67.34 9.76,65.75 R22.2
N$19
  Top 0.762: LED23.A 9.76,73.06 9.76,74.64 R23.2
N$20
  Top 0.762: LED24.A 8.17,73.06 8.17,74.64 R24.2
N$21
  Top 0.762: LED25.A 118.02,79.41 119.61,79.41 R25.2
N$22
  Top 0.762: LED26.A 118.02,80.68 119.61,80.68 R26.2
N$23
  Top 0.762: LED27.A 112.31,80.68 110.72,80.68 R27.2
N$24
  Top 0.762: LED28.A 112.31,79.41 110.72,79.41 R28.2
N$29
  Top 0.762: LED29.A 27.54,9.56 27.54,7.97 R29.2
N$30
  Top 0.762: LED30.A 29.12,9.56 29.12,7.97 R30.2
N$31
  Top 0.762: LED31.A 29.12,15.27 29.12,16.86 R31.2
N$32
  Top 0.762: LED32.A 27.54,15.27 27.54,16.86 R32.2
N$33
  Top 0.762: LED33.A 118.02,21.3 119.61,21.3 R33.2
N$34
  Top 0.762: LED34.A 118.02,22.89 119.61,22.89 R34.2
N$35
  Top 0.762: LED35.A 112.31,22.89 110.72,22.89 R35.2
N$36
  Top 0.762: LED36.A 112.31,21.3 110.72,21.3 R36.2
N$37
  Top 0.762: LED37.A 27.54,28.93 27.54,27.34 R37.2
N$38
  Top 0.762: LED38.A 29.12,28.93 29.12,27.34 R38.2
N$39
  Top 0.762: LED39.A 29.12,34.64 29.12,36.23 R39.2
N$40
  Top 0.762: LED40.A 27.54,34.64 27.54,36.23 R40.2
N$45
  Top 0.762: LED45.A 27.54,48.29 27.54,46.7 R45.2
N$46
  Top 0.762: LED46.A 29.12,48.29 29.12,46.7 R46.2
N$47
  Top 0.762: LED47.A 29.12,53.69 29.12,55.59 R47.2
N$48
  Top 0.762: LED48.A 27.54,53.69 27.54,55.59 R48.2
N$49
  Top 0.762: LED49.A 118.02,40.67 119.61,40.67 R49.2
N$50
  Top 0.762: LED50.A 118.02,42.26 119.61,42.26 R50.2
N$51
  Top 0.762: LED51.A 112.31,42.26 110.72,42.26 R51.2
N$52
  Top 0.762: LED52.A 112.31,40.67 110.72,40.67 R52.2
N$53
  Top 0.762: LED53.A 27.54,67.34 27.54,65.75 R53.2
N$54
  Top 0.762: LED54.A 29.12,67.34 29.12,65.75 R54.2
N$55
  Top 0.762: LED55.A 29.12,73.06 29.12,74.64 R55.2
N$56
  Top 0.762: LED56.A 27.54,73.06 27.54,74.64 R56.2
N$61
  Top 0.762: LED61.A 46.9,9.56 46.9,7.97 R61.2
N$62
  Top 0.762: LED62.A 48.17,9.56 48.17,7.97 R62.2
N$63
  Top 0.762: LED63.A 48.17,15.27 48.17,16.86 R63.2
N$64
  Top 0.762: LED64.A 46.9,15.27 46.9,16.86 R64.2
N$65
  Top 0.762: LED65.A 118.02,60.04 119.61,60.04 R65.2
N$66
  Top 0.762: LED66.A 118.02,61.63 119.61,61.63 R66.2
N$67
  Top 0.762: LED67.A 112.31,61.63 110.72,61.63 R67.2
N$68
  Top 0.762: LED68.A 112.31,60.04 110.72,60.04 R68.2
N$69
  Top 0.762: LED69.A 46.9,28.93 46.9,27.34 R69.2
N$70
  Top 0.762: LED70.A 48.17,28.93 48.17,27.34 R70.2
N$71
  Top 0.762: LED71.A 48.17,34.64 48.17,36.23 R71.2
N$72
  Top 0.762: LED72.A 46.9,34.64 46.9,36.23 R72.2
N$77
  Top 0.762: LED77.A 46.9,48.29 46.9,46.7 R77.2
N$78
  Top 0.762: LED78.A 48.17,48.29 48.17,46.7 R78.2
N$79
  Top 0.762: LED79.A 48.17,53.69 48.17,55.59 R79.2
N$80
  Top 0.762: LED80.A 46.9,53.69 46.9,55.59 R80.2
N$85
  Top 0.762: LED85.A 46.9,67.34 46.9,65.75 R85.2
N$86
  Top 0.762: LED86.A 48.17,67.34 48.17,65.75 R86.2
N$87
  Top 0.762: LED87.A 48.17,73.06 48.17,74.64 R87.2
N$88
  Top 0.762: LED88.A 46.9,73.06 46.9,74.64 R88.2
N$93
  Top 0.762: LED93.A 65.95,9.56 65.95,7.97 R93.2
N$94
  Top 0.762: LED94.A 67.54,9.56 67.54,7.97 R94.2
N$95
  Top 0.762: LED95.A 67.54,15.27 67.54,16.86 R95.2
N$96
  Top 0.762: LED96.A 65.95,15.27 65.95,16.86 R96.2
N$101
  Top 0.762: LED101.A 65.95,28.93 65.95,27.34 R101.2
N$102
  Top 0.762: LED102.A 67.54,28.93 67.54,27.34 R102.2
N$103
  Top 0.762: LED103.A 67.54,34.64 67.54,36.23 R103.2
N$104
  Top 0.762: LED104.A 65.95,34.64 65.95,36.23 R104.2
N$109
  Top 0.762: LED109.A 65.95,48.29 65.95,46.7 R109.2
N$110
  Top 0.762: LED110.A 67.54,48.29 67.54,46.7 R110.2
N$111
  Top 0.762: LED111.A 67.54,53.69 67.54,55.59 R111.2
N$112
  Top 0.762: LED112.A 65.95,53.69 65.95,55.59 R112.2
N$117
  Top 0.762: LED117.A 65.95,67.34 65.95,65.75 R117.2
N$118
  Top 0.762: LED118.A 67.54,67.34 67.54,65.75 R118.2
N$119
  Top 0.762: LED119.A 67.54,73.06 67.54,74.64 R119.2
N$120
  Top 0.762: LED120.A 65.95,73.06 65.95,74.64 R120.2
N$125
  Top 0.762: LED125.A 85.32,9.56 85.32,7.97 R125.2
N$126
  Top 0.762: LED126.A 86.91,9.56 86.91,7.97 R126.2
N$127
  Top 0.762: LED127.A 86.91,15.27 86.91,16.86 R127.2
N$128
  Top 0.762: LED128.A 85.32,15.27 85.32,16.86 R128.2
N$133
  Top 0.762: LED133.A 85.32,28.93 85.32,27.34 R133.2
N$134
  Top 0.762: LED134.A 86.91,28.93 86.91,27.34 R134.2
N$135
  Top 0.762: LED135.A 86.91,34.64 86.91,36.23 R135.2
N$136
  Top 0.762: LED136.A 85.32,34.64 85.32,36.23 R136.2
N$141
  Top 0.762: LED141.A 85.32,48.29 85.32,46.7 R141.2
N$142
  Top 0.762: LED142.A 86.91,48.29 86.91,46.7 R142.2
N$143
  Top 0.762: LED143.A 86.91,53.69 86.91,55.59 R143.2
N$144
  Top 0.762: LED144.A 85.32,53.69 85.32,55.59 R144.2
N$149
  Top 0.762: LED149.A 85.32,67.34 85.32,65.75 R149.2
N$150
  Top 0.762: LED150.A 86.91,67.34 86.91,65.75 R150.2
N$151
  Top 0.762: LED151.A 86.91,73.06 86.91,74.64 R151.2
N$152
  Top 0.762: LED152.A 85.32,73.06 85.32,74.64 R152.2
N$157
  Top 0.762: LED157.A 104.69,9.56 104.69,7.97 R157.2
N$158
  Top 0.762: LED158.A 106.28,9.56 106.28,7.97 R158.2
N$159
  Top 0.762: LED159.A 106.28,15.27 106.28,16.86 R159.2
N$160
  Top 0.762: LED160.A 104.69,15.27 104.69,16.86 R160.2
N$165
  Top 0.762: LED165.A 104.69,28.93 104.69,27.34 R165.2
N$166
  Top 0.762: LED166.A 106.28,28.93 106.28,27.34 R166.2
N$167
  Top 0.762: LED167.A 106.28,34.64 106.28,36.23 R167.2
N$168
  Top 0.762: LED168.A 104.69,34.64 104.69,36.23 R168.2
N$173
  Top 0.762: LED173.A 104.69,48.29 104.69,46.7 R173.2
N$174
  Top 0.762: LED174.A 106.28,48.29 106.28,46.7 R174.2
N$175
  Top 0.762: LED175.A 106.28,53.69 106.28,55.59 R175.2
N$176
  Top 0.762: LED176.A 104.69,53.69 104.69,55.59 R176.2
N$181
  Top 0.762: LED181.A 104.69,67.34 104.69,65.75 R181.2
N$182
  Top 0.762: LED182.A 106.28,67.34 106.28,65.75 R182.2
N$183
  Top 0.762: LED183.A 106.28,73.06 106.28,74.64 R183.2
N$184
  Top 0.762: LED184.A 104.69,73.06 104.69,74.64 R184.2
N$189
  Top 0.762: LED189.A 124.06,9.56 124.06,7.97 R189.2
N$190
  Top 0.762: LED190.A 125.64,9.56 125.64,7.97 R190.2
N$191
  Top 0.762: LED191.A 125.64,15.27 125.64,16.86 R191.2
N$192
  Top 0.762: LED192.A 124.06,15.27 124.06,16.86 R192.2
N$197
  Top 0.762: LED197.A 124.06,28.93 124.06,27.34 R197.2
N$198
  Top 0.762: LED198.A 125.64,28.93 125.64,27.34 R198.2
N$199
  Top 0.762: LED199.A 125.64,34.64 125.64,36.23 R199.2
N$200
  Top 0.762: LED200.A 124.06,34.64 124.06,36.23 R200.2
N$205
  Top 0.762: LED205.A 124.06,48.29 124.06,46.7 R205.2
N$206
  Top 0.762: LED206.A 125.64,48.29 125.64,46.7 R206.2
N$207
  Top 0.762: LED207.A 125.64,53.69 125.64,55.59 R207.2
N$208
  Top 0.762: LED208.A 124.06,53.69 124.06,55.59 R208.2
N$213
  Top 0.762: LED213.A 124.06,67.34 124.06,65.75 R213.2
N$214
  Top 0.762: LED214.A 125.64,67.34 125.64,65.75 R214.2
N$215
  Top 0.762: LED215.A 125.64,73.06 125.64,74.64 R215.2
N$216
  Top 0.762: LED216.A 124.06,73.06 124.06,74.64 R216.2
N$221
  Top 0.762: LED221.A 21.5,79.41 23.09,79.41 R221.2
N$222
  Top 0.762: LED222.A 21.5,80.68 23.09,80.68 R222.2
N$223
  Top 0.762: LED223.A 15.79,80.68 14.2,80.68 R223.2
N$224
  Top 0.762: LED224.A 15.79,79.41 14.2,79.41 R224.2
N$229
  Top 0.762: R229.2 LED229.A
N$230
  Top 0.762: LED230.A R230.2
N$231
  Top 0.762: R231.2 LED231.A
N$232
  Top 0.762: LED232.A R232.2
N$237
  Top 0.762: LED237.A 21.5,40.67 23.09,40.67 R237.2
N$238
  Top 0.762: LED238.A 21.5,42.26 23.09,42.26 R238.2
N$239
  Top 0.762: LED239.A 15.79,42.26 14.2,42.26 R239.2
N$240
  Top 0.762: LED240.A 15.79,40.67 14.2,40.67 R240.2
N$245
  Top 0.762: LED245.A 21.5,21.3 23.09,21.3 R245.2
N$246
  Top 0.762: LED246.A 21.5,22.89 23.09,22.89 R246.2
N$247
  Top 0.762: LED247.A 15.79,22.89 14.2,22.89 R247.2
N$248
  Top 0.762: LED248.A 15.79,21.3 14.2,21.3 R248.2
N$253
  Top 0.762: LED253.A 21.5,1.94 23.09,1.94 R253.2
N$254
  Top 0.762: LED254.A 21.5,3.52 23.09,3.52 R254.2
N$255
  Top 0.762: LED255.A 15.79,3.52 14.2,3.52 R255.2
N$256
  Top 0.762: LED256.A 15.79,1.94 14.2,1.94 R256.2
N$261
  Top 0.762: LED261.A 40.55,1.94 42.46,1.94 R261.2
N$262
  Top 0.762: LED262.A 40.55,3.52 42.46,3.52 R262.2
N$263
  Top 0.762: LED263.A 35.16,3.52 33.57,3.52 R263.2
N$264
  Top 0.762: LED264.A 35.16,1.94 33.57,1.94 R264.2
N$269
  Top 0.762: LED269.A 40.55,21.3 42.46,21.3 R269.2
N$270
  Top 0.762: LED270.A 40.55,22.89 42.46,22.89 R270.2
N$271
  Top 0.762: LED271.A 35.16,22.89 33.57,22.89 R271.2
N$272
  Top 0.762: LED272.A 35.16,21.3 33.57,21.3 R272.2
N$277
  Top 0.762: LED277.A 40.55,40.67 42.46,40.67 R277.2
N$278
  Top 0.762: LED278.A 40.55,42.26 42.46,42.26 R278.2
N$279
  Top 0.762: LED279.A 35.16,42.26 33.57,42.26 R279.2
N$280
  Top 0.762: LED280.A 35.16,40.67 33.57,40.67 R280.2
N$285
  Top 0.762: LED285.A 40.55,60.04 42.46,60.04 R285.2
N$286
  Top 0.762: LED286.A 40.55,61.63 42.46,61.63 R286.2
N$287
  Top 0.762: LED287.A 35.16,61.63 33.57,61.63 R287.2
N$288
  Top 0.762: LED288.A 35.16,60.04 33.57,60.04 R288.2
N$293
  Top 0.762: LED293.A 40.55,79.41 42.46,79.41 R293.2
N$294
  Top 0.762: LED294.A 40.55,80.68 42.46,80.68 R294.2
N$295
  Top 0.762: LED295.A 35.16,80.68 33.57,80.68 R295.2
N$296
  Top 0.762: LED296.A 35.16,79.41 33.57,79.41 R296.2
N$301
  Top 0.762: LED301.A 59.92,1.94 61.51,1.94 R301.2
N$302
  Top 0.762: LED302.A 59.92,3.52 61.51,3.52 R302.2
N$303
  Top 0.762: LED303.A 54.52,3.52 52.62,3.52 R303.2
N$304
  Top 0.762: LED304.A 54.52,1.94 52.62,1.94 R304.2
N$309
  Top 0.762: LED309.A 59.92,21.3 61.51,21.3 R309.2
N$310
  Top 0.762: LED310.A 59.92,22.89 61.51,22.89 R310.2
N$311
  Top 0.762: LED311.A 54.52,22.89 52.62,22.89 R311.2
N$312
  Top 0.762: LED312.A 54.52,21.3 52.62,21.3 R312.2
N$317
  Top 0.762: LED317.A 59.92,40.67 61.51,40.67 R317.2
N$318
  Top 0.762: LED318.A 59.92,42.26 61.51,42.26 R318.2
N$319
  Top 0.762: LED319.A 54.52,42.26 52.62,42.26 R319.2
N$320
  Top 0.762: LED320.A 54.52,40.67 52.62,40.67 R320.2
N$325
  Top 0.762: LED325.A 59.92,60.04 61.51,60.04 R325.2
N$326
  Top 0.762: LED326.A 59.92,61.63 61.51,61.63 R326.2
N$327
  Top 0.762: LED327.A 54.52,61.63 52.62,61.63 R327.2
N$328
  Top 0.762: LED328.A 54.52,60.04 52.62,60.04 R328.2
N$333
  Top 0.762: LED333.A 59.92,79.41 61.51,79.41 R333.2
N$334
  Top 0.762: LED334.A 59.92,80.68 61.51,80.68 R334.2
N$335
  Top 0.762: LED335.A 54.52,80.68 52.62,80.68 R335.2
N$336
  Top 0.762: LED336.A 54.52,79.41 52.62,79.41 R336.2
N$341
  Top 0.762: LED341.A 79.29,1.94 80.88,1.94 R341.2
N$342
  Top 0.762: LED342.A 79.29,3.52 80.88,3.52 R342.2
N$343
  Top 0.762: LED343.A 73.57,3.52 71.99,3.52 R343.2
N$344
  Top 0.762: LED344.A 73.57,1.94 71.99,1.94 R344.2
N$349
  Top 0.762: LED349.A 79.29,21.3 80.88,21.3 R349.2
N$350
  Top 0.762: LED350.A 79.29,22.89 80.88,22.89 R350.2
N$351
  Top 0.762: LED351.A 73.57,22.89 71.99,22.89 R351.2
N$352
  Top 0.762: LED352.A 73.57,21.3 71.99,21.3 R352.2
N$357
  Top 0.762: LED357.A 79.29,40.67 80.88,40.67 R357.2
N$358
  Top 0.762: LED358.A 79.29,42.26 80.88,42.26 R358.2
N$359
  Top 0.762: LED359.A 73.57,42.26 71.99,42.26 R359.2
N$360
  Top 0.762: LED360.A 73.57,40.67 71.99,40.67 R360.2
N$365
  Top 0.762: LED365.A 79.29,60.04 80.88,60.04 R365.2
N$366
  Top 0.762: LED366.A 79.29,61.63 80.88,61.63 R366.2
N$367
  Top 0.762: LED367.A 73.57,61.63 71.99,61.63 R367.2
N$368
  Top 0.762: LED368.A 73.57,60.04 71.99,60.04 R368.2
N$373
  Top 0.762: LED373.A 79.29,79.41 80.88,79.41 R373.2
N$374
  Top 0.762: LED374.A 79.29,80.68 80.88,80.68 R374.2
N$375
  Top 0.762: LED375.A 73.57,80.68 71.99,80.68 R375.2
N$376
  Top 0.762: LED376.A 73.57,79.41 71.99,79.41 R376.2
N$381
  Top 0.762: LED381.A 98.66,1.94 100.24,1.94 R381.2
N$382
  Top 0.762: LED382.A 98.66,3.52 100.24,3.52 R382.2
N$383
  Top 0.762: LED383.A 92.94,3.52 91.35,3.52 R383.2
N$384
  Top 0.762: LED384.A 92.94,1.94 91.35,1.94 R384.2
N$389
  Top 0.762: LED389.A 98.66,21.3 100.24,21.3 R389.2
N$390
  Top 0.762: LED390.A 98.66,22.89 100.24,22.89 R390.2
N$391
  Top 0.762: LED391.A 92.94,22.89 91.35,22.89 R391.2
N$392
  Top 0.762: LED392.A 92.94,21.3 91.35,21.3 R392.2
N$397
  Top 0.762: LED397.A 98.66,40.67 100.24,40.67 R397.2
N$398
  Top 0.762: LED398.A 98.66,42.26 100.24,42.26 R398.2
N$399
  Top 0.762: LED399.A 92.94,42.26 91.35,42.26 R399.2
N$400
  Top 0.762: LED400.A 92.94,40.67 91.35,40.67 R400.2
N$405
  Top 0.762: LED405.A 98.66,60.04 100.24,60.04 R405.2
N$406
  Top 0.762: LED406.A 98.66,61.63 100.24,61.63 R406.2
N$407
  Top 0.762: LED407.A 92.94,61.63 91.35,61.63 R407.2
N$408
  Top 0.762: LED408.A 92.94,60.04 91.35,60.04 R408.2
N$413
  Top 0.762: LED413.A 98.66,79.41 100.24,79.41 R413.2
N$414
  Top 0.762: LED414.A 98.66,80.68 100.24,80.68 R414.2
N$415
  Top 0.762: LED415.A 92.94,80.68 91.35,80.68 R415.2
N$416
  Top 0.762: LED416.A 92.94,79.41 91.35,79.41 R416.2
P1
  pour Top: -21.36,0.35 128.64,0.35 128.64,90.35 -21.36,90.35

## Text on the board
tPlace: 24-Well LED R6